# EAGLE schematic Power Supply (EAGLE 7.1.0)
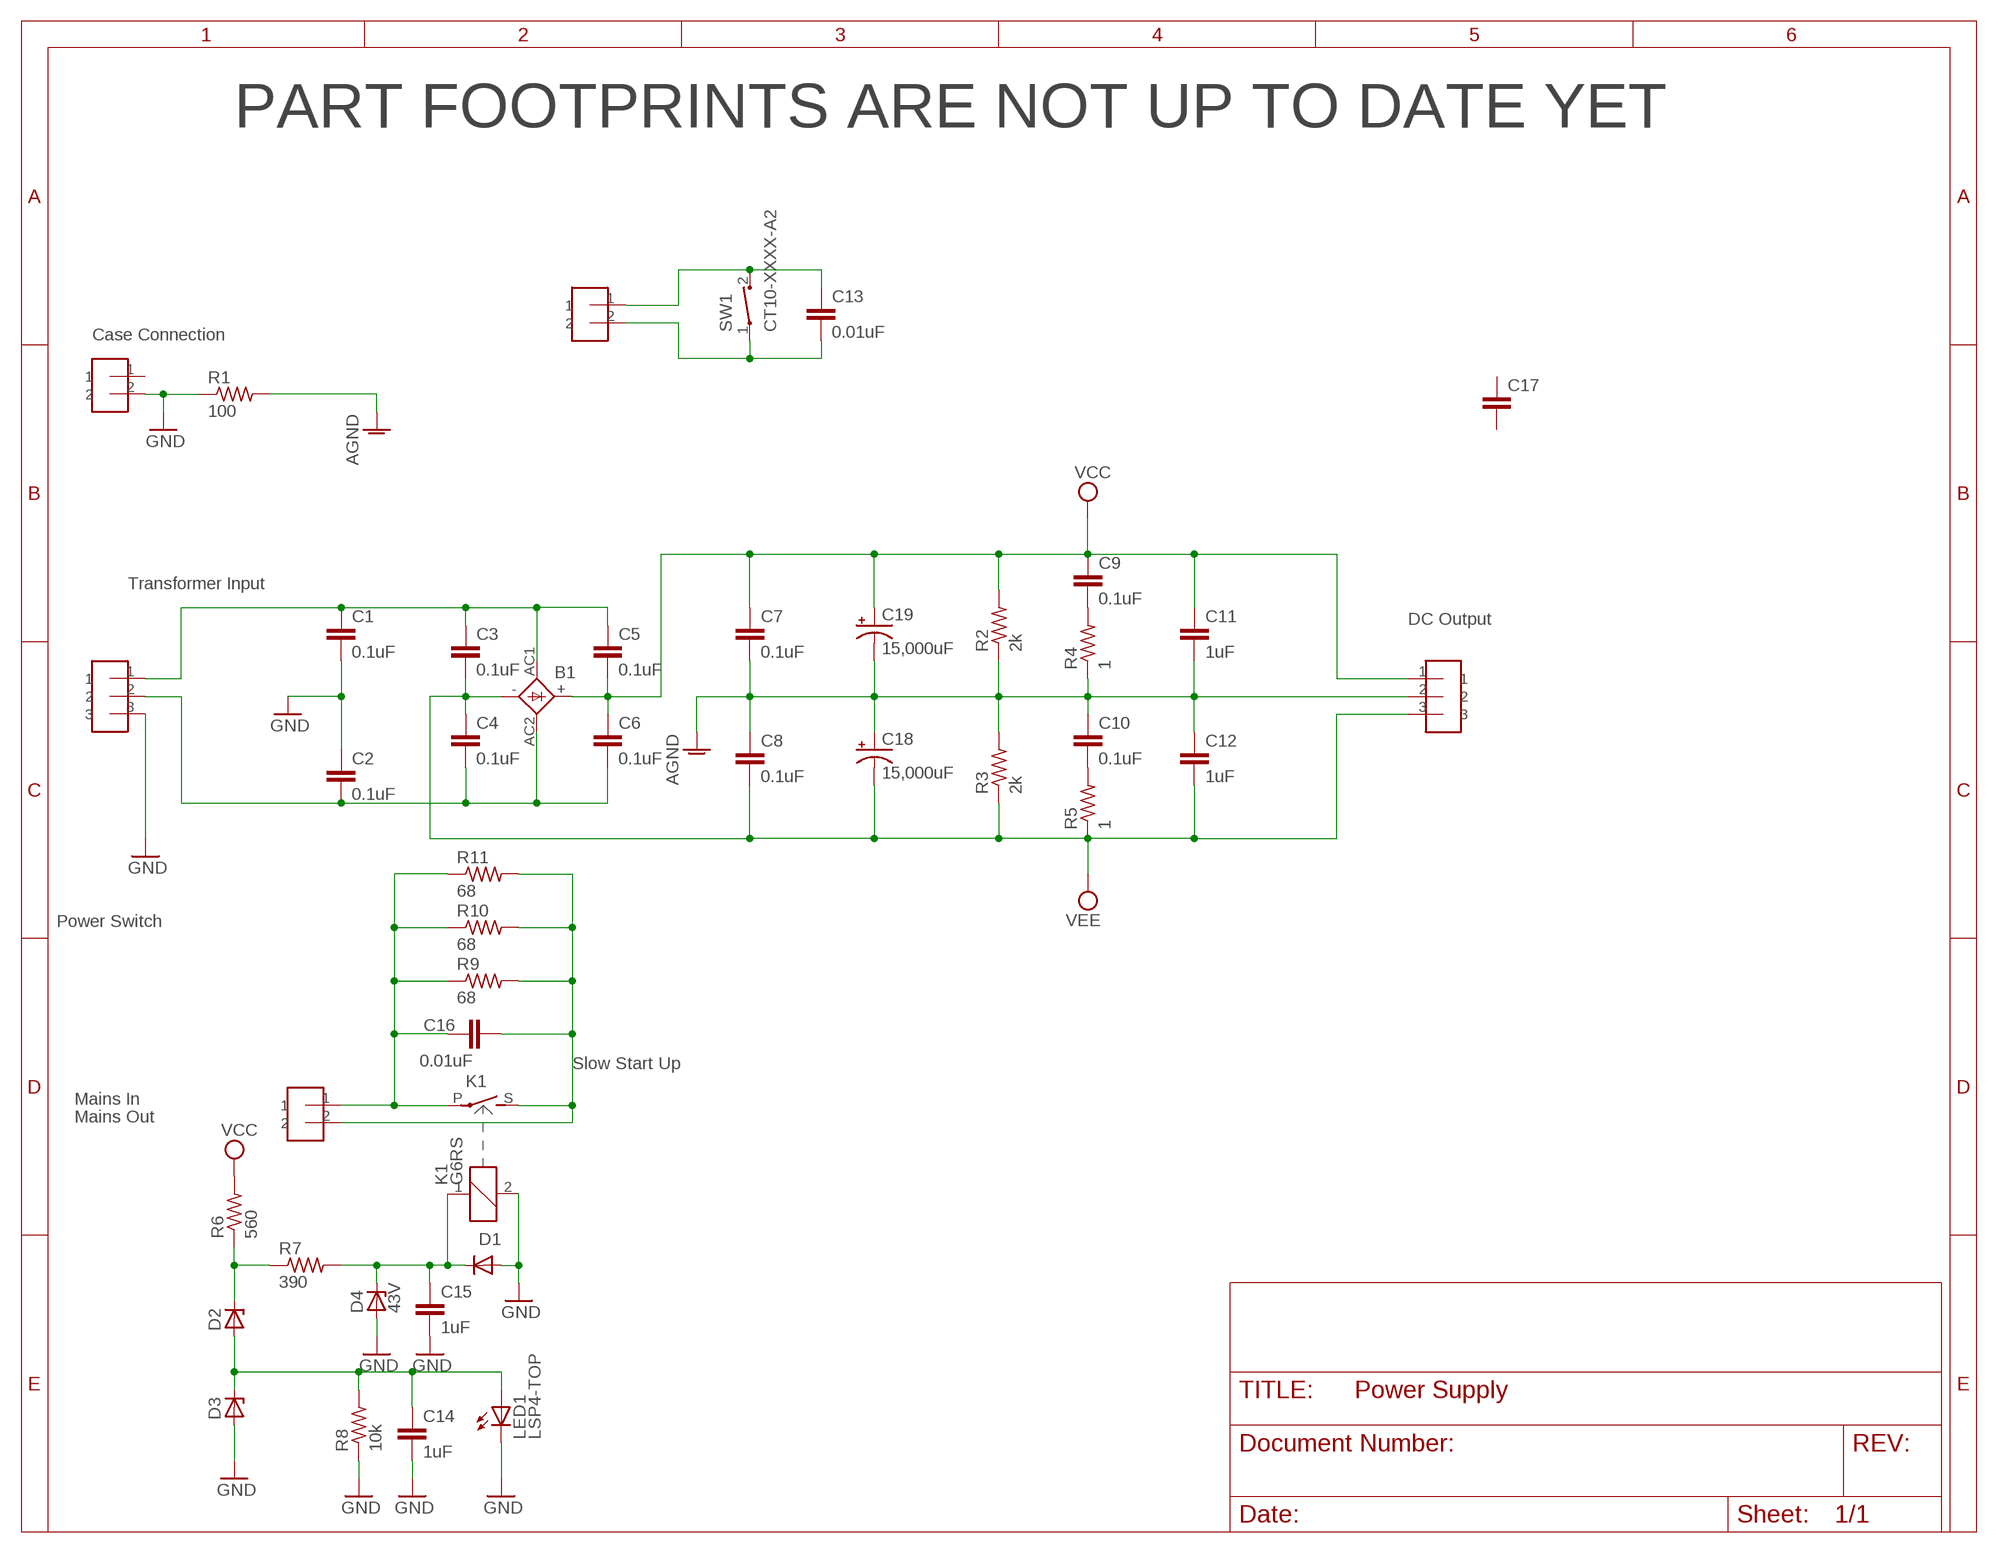
[diagram p0: schematic, sheet 1]

## Parts
B1  GBPC1  [GBPC1]
C1  0.1uF  C-EU025-060X050  [C025-060X050]
C2  0.1uF  C-EU025-060X050  [C025-060X050]
C3  0.1uF  C-EU025-060X050  [C025-060X050]
C4  0.1uF  C-EU025-060X050  [C025-060X050]
C5  0.1uF  C-EU025-060X050  [C025-060X050]
C6  0.1uF  C-EU025-060X050  [C025-060X050]
C7  0.1uF  C-EU025-060X050  [C025-060X050]
C8  0.1uF  C-EU025-060X050  [C025-060X050]
C9  0.1uF  C-EU025-060X050  [C025-060X050]
C10  0.1uF  C-EU025-060X050  [C025-060X050]
C11  1uF  C-EU025-060X050  [C025-060X050]
C12  1uF  C-EU025-060X050  [C025-060X050]
C13  0.01uF  C-EU025-060X050  [C025-060X050]
C14  1uF  C-EU025-060X050  [C025-060X050]
C15  1uF  C-EU025-060X050  [C025-060X050]
C16  0.01uF  C-EU025-060X050  [C025-060X050]
C17  C-EU025-060X050  [C025-060X050]
C18  15,000uF  CPOL-USE7.5-16  [E7,5-16]
C19  15,000uF  CPOL-USE7.5-16  [E7,5-16]
D1  1N4004  [DO41-10]
D2  ZENER-DIODEDO34-7  [DO34Z7]
D3  ZENER-DIODEDO34-7  [DO34Z7]
D4  43V  ZENER-DIODEDO34-7  [DO34Z7]
K1  G6RS  [G6RS]
LED1  LSP4-TOP  [P47F-TOP]
R1  100  R-US_0617/22  [0617/22]
R2  2k  R-US_0617/22  [0617/22]
R3  2k  R-US_0617/22  [0617/22]
R4  1  R-US_0617/22  [0617/22]
R5  1  R-US_0617/22  [0617/22]
R6  560  R-US_0617/22  [0617/22]
R7  390  R-US_0617/22  [0617/22]
R8  10k  R-US_0617/22  [0617/22]
R9  68  R-US_0617/22  [0617/22]
R10  68  R-US_0617/22  [0617/22]
R11  68  R-US_0617/22  [0617/22]
SW1  CT10-XXXX-A2  [CT10-XXXX-A2]
U$1  1X3HEADER_100MIL  [1X3_100MIL]
U$2  1X3HEADER_100MIL  [1X3_100MIL]
U$3  1X2HEADER_100MIL  [1X2_100MIL]
U$4  1X2HEADER_100MIL  [1X2_100MIL]
U$5  1X2HEADER_100MIL  [1X2_100MIL]

## Nets
AGND: C7.2 C8.1 C10.1 C11.2 C12.1 C18.+ C19.- R1.2 R2.1 R3.2 R4.1 U$2.2
GND: C1.2 C2.1 C14.2 C15.2 D1.A D3.A D4.A K1.2 LED1.C R1.1 R8.1 U$1.3 U$3.2
N$1: C10.2 R5.2
N$2: C9.2 R4.2
N$3: C16.1 K1.P(2:P) R9.1 R10.1 R11.1 U$4.1
N$4: B1.AC2 C2.2 C4.2 C6.2 U$1.2
N$5: C13.1 SW1.2 U$5.1
N$6: B1.AC1 C1.1 C3.1 C5.1 U$1.1
N$7: C13.2 SW1.1 U$5.2
N$8: C16.2 K1.S(2:S) R9.2 R10.2 R11.2 U$4.2
N$10: C15.1 D1.C D4.C K1.1 R7.2
N$11: D2.C R6.1 R7.1
N$12: C14.1 D2.A D3.C LED1.A R8.2
VCC: B1.+ C5.2 C6.1 C7.1 C9.1 C11.1 C19.+ R2.2 R6.2 U$2.1
VEE: B1.- C3.2 C4.1 C8.2 C12.2 C18.- R3.1 R5.1 U$2.3
Unconnected: C17.1 C17.2 U$3.1

## Notes on the sheet
- PART FOOTPRINTS ARE NOT UP TO DATE YET
- Case Connection
- Transformer Input
- DC Output
- Power Switch
- Slow Start Up
- Mains In
- Mains Out

## Library data of the parts
B1 = rectifier:GBPC1: GENERAL INSTRUMENT RECTIFIER
C1-C17 = rcl:C-EU: CAPACITOR, European symbol
C18 C19 = rcl:CPOL-US: POLARIZED CAPACITOR, American symbol
D1 = diode:1N4004: DIODE general purpose rectifier, 1 A
D2-D4 = diode:ZENER-DIODE: Z-Diode
K1 = relay:G6RS: RELAY 1 x norm. open, Omron; OC_FARNELL: unknown; OC_NEWARK: unknown
LED1 = led:*P4: PointLED® Enhanced Thinfilm LED TOP & BOTTOM mount LS P47F, LR P47F, LA P47F, LY P47F, LT P4SG, LB P4SG, LW P4SG Source: http://catalog.osram-os.com .. LA_LR_LS_LY_P47F_Pb_free.pdf
R1-R11 = rcl:R-US_: RESISTOR, American symbol
SW1 = switch-coto:CT10-XXXX-: CT10 Series Molded Switch Source: www.cotorelay.com .. Coto_Technology__CT10-1530-G1.pdf
U$1 U$2 = Headers:1X3HEADER_100MIL
U$3-U$5 = Headers:1X2HEADER_100MIL